# EAGLE design OmniRotor-1_0 (EAGLE 5.10)
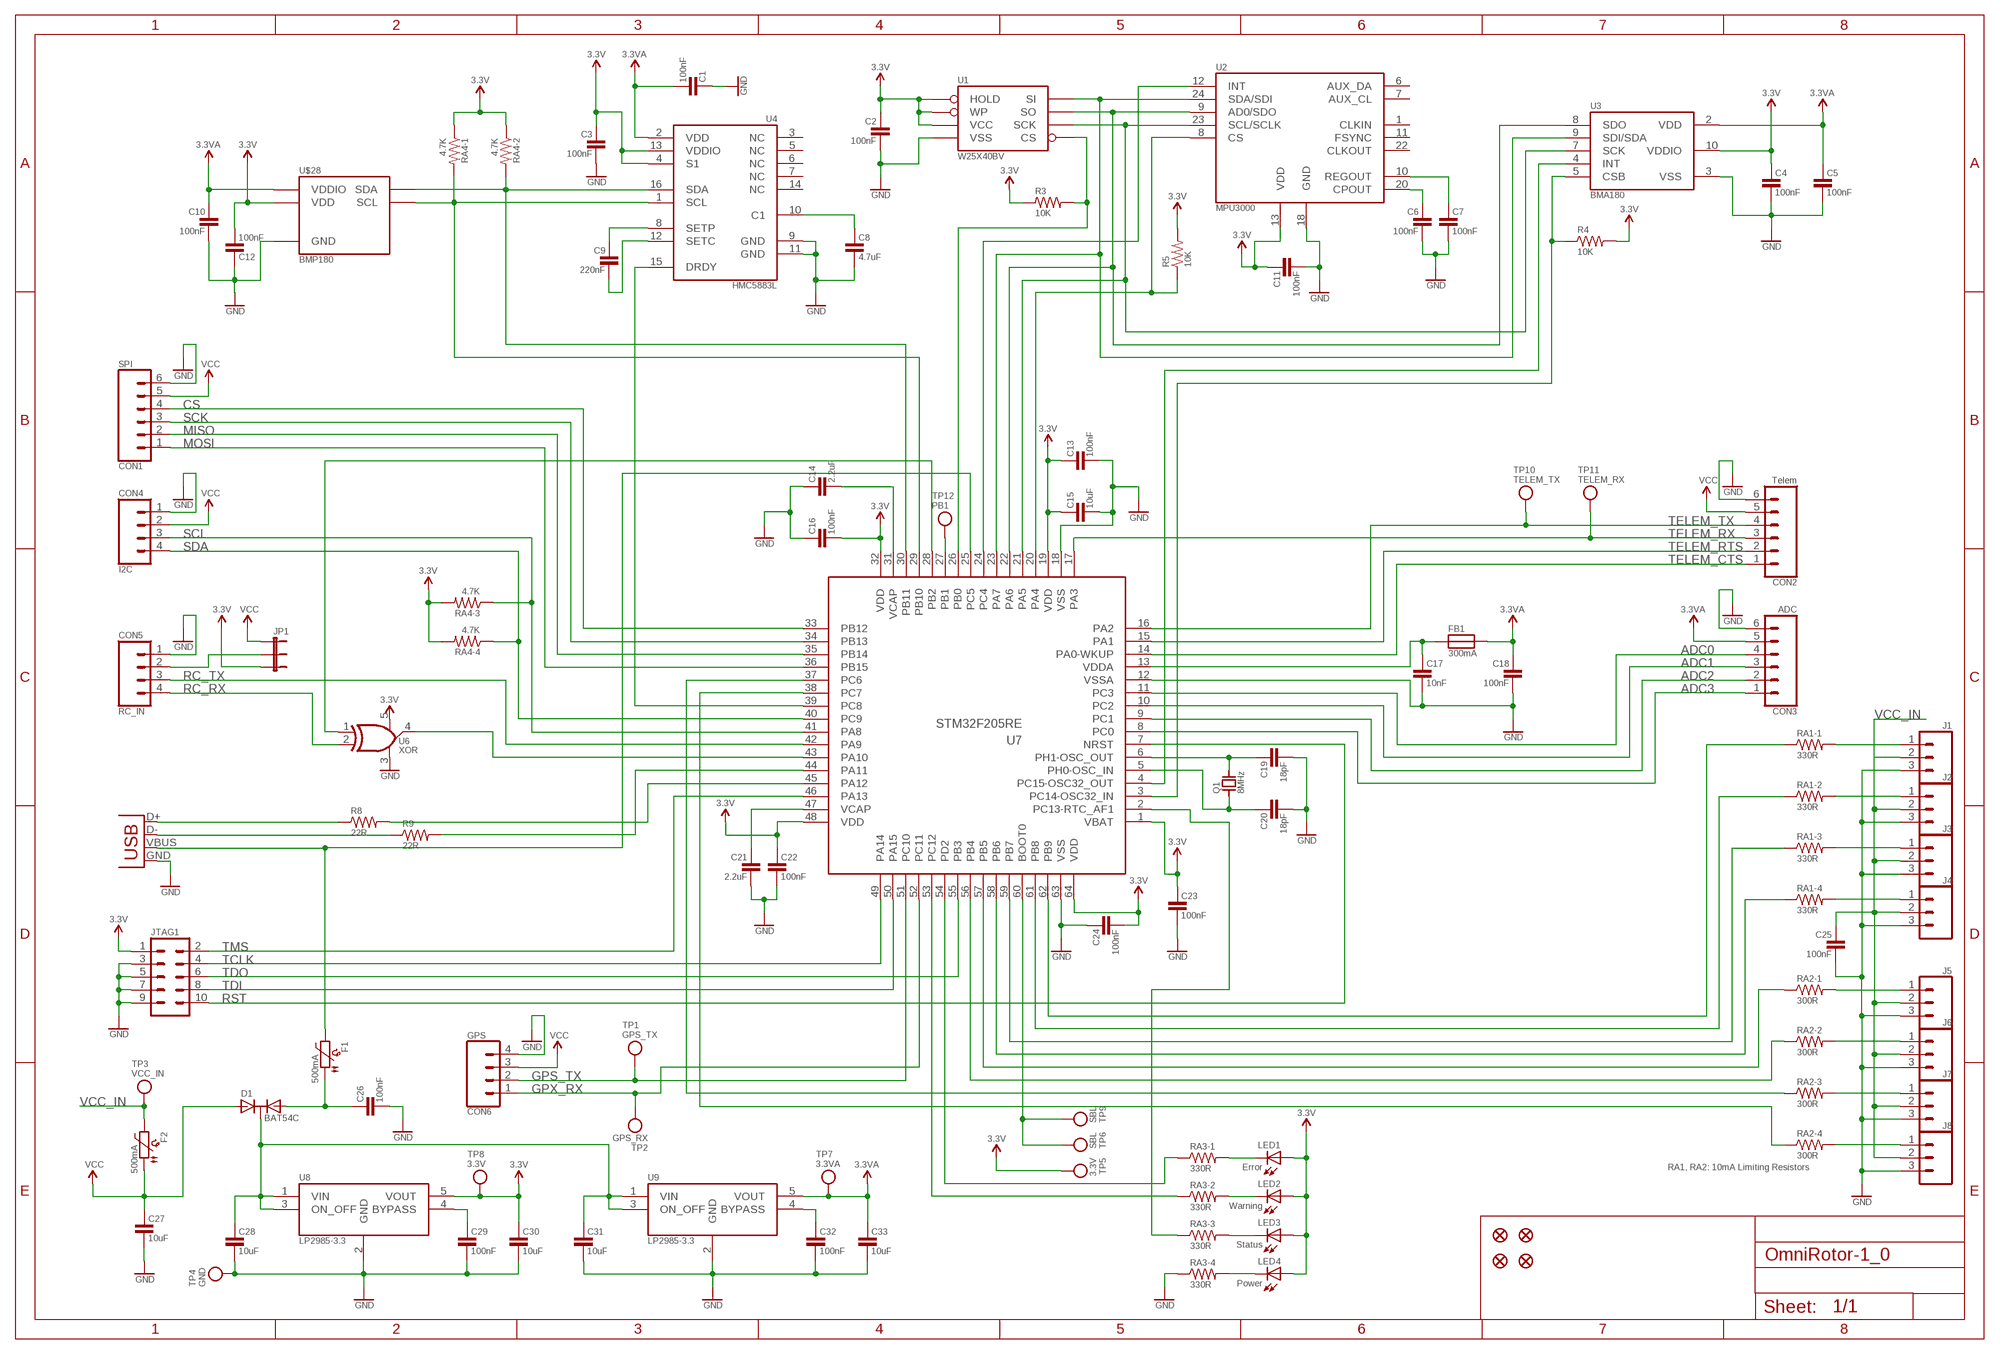
[diagram p0: schematic, sheet 1]

## Parts
C1  100nF  CAPACITOR0402  [0402-CAP]
C2  100nF  CAPACITOR0402  [0402-CAP]
C3  100nF  CAPACITOR0402  [0402-CAP]
C4  100nF  CAPACITOR0402  [0402-CAP]
C5  100nF  CAPACITOR0402  [0402-CAP]
C6  100nF  CAPACITOR0402  [0402-CAP]
C7  100nF  CAPACITOR0402  [0402-CAP]
C8  4.7uF  CAPACITOR0603  [0603]
C9  220nF  CAPACITOR0402  [0402-CAP]
C10  100nF  CAPACITOR0402  [0402-CAP]
C11  100nF  CAPACITOR0402  [0402-CAP]
C12  100nF  CAPACITOR0402  [0402-CAP]
C13  100nF  CAPACITOR0402  [0402-CAP]
C14  2.2uF  CAPACITOR0603  [0603]
C15  10uF  CAPACITOR-CERAMIC0805  [0805]
C16  100nF  CAPACITOR0402  [0402-CAP]
C17  10nF  CAPACITOR0402  [0402-CAP]
C18  100nF  CAPACITOR0402  [0402-CAP]
C19  18pF  CAPACITOR0402  [0402-CAP]
C20  18pF  CAPACITOR0402  [0402-CAP]
C21  2.2uF  CAPACITOR0603  [0603]
C22  100nF  CAPACITOR0402  [0402-CAP]
C23  100nF  CAPACITOR0402  [0402-CAP]
C24  100nF  CAPACITOR0402  [0402-CAP]
C25  100nF  CAPACITOR0402  [0402-CAP]
C26  100nF  CAPACITOR0402  [0402-CAP]
C27  10uF  CAPACITOR-CERAMIC0805  [0805]
C28  10uF  CAPACITOR-CERAMIC0805  [0805]
C29  100nF  CAPACITOR0402  [0402-CAP]
C30  10uF  CAPACITOR-CERAMIC0805  [0805]
C31  10uF  CAPACITOR-CERAMIC0805  [0805]
C32  100nF  CAPACITOR0402  [0402-CAP]
C33  10uF  CAPACITOR-CERAMIC0805  [0805]
CON1  SPI  M06JST-SH-SIDE  [SM06B-SRSS-TB]
CON2  Telem  M06JST-SH-SIDE  [SM06B-SRSS-TB]
CON3  ADC  M06JST-SH-SIDE  [SM06B-SRSS-TB]
CON4  I2C  M04JST-SH-SIDE  [SM04B-SRSS-TB]
CON5  RC_IN  M04JST-SH-SIDE  [SM04B-SRSS-TB]
CON6  GPS  M04JST-SH-SIDE  [SM04B-SRSS-TB]
D1  BAT54C  [SOT23]
F1  500mA  PTC1812  [1812]
F2  500mA  PTC1812  [1812]
FB1  300mA  FERRITE0603  [0603]
FID1  FIDUCIAL1X2.5  [FIDUCIAL-1X2.5]
FID2  FIDUCIAL1X2.5  [FIDUCIAL-1X2.5]
FID3  FIDUCIAL1X2.5  [FIDUCIAL-1X2.5]
FID4  FIDUCIAL1X2.5  [FIDUCIAL-1X2.5]
J1  M03PTH  [1X03]
J2  M03PTH  [1X03]
J3  M03PTH  [1X03]
J4  M03PTH  [1X03]
J5  M03PTH  [1X03]
J6  M03PTH  [1X03]
J7  M03PTH  [1X03]
J8  M03PTH  [1X03]
JP1  JUMPER-32-3  [SJ_3_PASTE2&3]
JTAG1  JTAGSWD  [2X05-0.05IN]
LED1  Error  LED0603  [0603_LED]
LED2  Warning  LED0603  [0603_LED]
LED3  Status  LED0603  [0603_LED]
LED4  Power  LED0603  [0603_LED]
Q1  8MHz  CRYSTAL5X3  [CRYSTAL-5X3]
R3  10K  RESISTOR0402  [0402-RES]
R4  10K  RESISTOR0402  [0402-RES]
R5  10K  RESISTOR0402  [0402-RES]
R8  22R  RESISTOR0402  [0402-RES]
R9  22R  RESISTOR0402  [0402-RES]
RA1  330R  RESISTOR-ARRAY-1206  [1206-ARRAY]
RA2  300R  RESISTOR-ARRAY-1206  [1206-ARRAY]
RA3  330R  RESISTOR-ARRAY-1206  [1206-ARRAY]
RA4  4.7K  RESISTOR-ARRAY-1206  [1206-ARRAY]
TP1  GPS_TX  TESTPOINTROUND1MM  [TESTPOINT_ROUND_1MM]
TP2  GPS_RX  TESTPOINTROUND1MM  [TESTPOINT_ROUND_1MM]
TP3  VCC_IN  TESTPOINTROUND1.5MM  [TESTPOINT_ROUND_1.5MM]
TP4  GND  TESTPOINTROUND1.5MM  [TESTPOINT_ROUND_1.5MM]
TP5  3.3V  TESTPOINTROUND1.5MM  [TESTPOINT_ROUND_1.5MM]
TP6  SBL  TESTPOINTROUND1.5MM  [TESTPOINT_ROUND_1.5MM]
TP7  3.3VA  TESTPOINTROUND1MM  [TESTPOINT_ROUND_1MM]
TP8  3.3V  TESTPOINTROUND1MM  [TESTPOINT_ROUND_1MM]
TP9  SBL  TESTPOINTROUND1MM  [TESTPOINT_ROUND_1MM]
TP10  TELEM_TX  TESTPOINTROUND1MM  [TESTPOINT_ROUND_1MM]
TP11  TELEM_RX  TESTPOINTROUND1MM  [TESTPOINT_ROUND_1MM]
TP12  PB1  TESTPOINTROUND1MM  [TESTPOINT_ROUND_1MM]
U1  W25X40BV  W25X40BVSOIC  [SOIC8]
U2  MPU3000  [QFN-24]
U3  BMA180  [LGA12]
U4  HMC5883L  [16LPCC]
U6  XOR  74LVC1G86SC70  [SC-70-5]
U7  STM32F205RE  [LQFP64]
U8  LP2985-3.3  LP2985  [SOT-23-5]
U9  LP2985-3.3  LP2985  [SOT-23-5]
U$28  BMP180  [BMP180]
USB1  USB-MICRO-B  USBMICRO-B  [USB-MICRO-B]

## Nets
3.3V: C2.1 C3.1 C4.1 C11.1 C12.2 C13.1 C15.1 C16.2 C22.1 C23.1 C24.2 C30.1 JP1.3 JTAG1.1 LED1.1(A) LED2.1(A) LED3.1(A) LED4.1(A) R3.1 R4.2 R5.2 RA4.A1 RA4.B1 RA4.C2 RA4.D2 TP5.1 TP8.1 U1.3(WP) U1.7(HOLD) U1.8(VCC) U2.13(VDD) U3.10(VDDIO) U4.4(S1) U4.13(VDDIO) U6.5(VCC) U7.1(VBAT) U7.19(VDD) U7.32(VDD) U7.48(VDD) U7.64(VDD) U8.5(VOUT)
3.3VA: C1.2 C5.1 C10.1 C18.1 C33.1 CON3.5 FB1.2 TP7.1 U3.2(VDD) U4.2(VDD) U9.5(VOUT) U$28.3(VDDIO)
ADC0: CON3.4 U7.11(PC3)
ADC1: CON3.3 U7.10(PC2)
ADC2: CON3.2 U7.9(PC1)
ADC3: CON3.1 U7.8(PC0)
CS: CON1.4 U7.33(PB12)
GND: C1.1 C2.2 C3.2 C4.2 C5.2 C6.2 C7.2 C8.2 C10.2 C11.2 C12.1 C13.2 C14.1 C15.2 C16.1 C17.2 C18.2 C19.2 C20.2 C21.2 C22.2 C23.2 C24.1 C25.2 C26.2 C27.2 C28.2 C29.2 C30.2 C31.2 C32.2 C33.2 CON1.6 CON2.6 CON3.6 CON4.1 CON5.1 CON6.4 J1.3 J2.3 J3.3 J4.3 J5.3 J6.3 J7.3 J8.3 JTAG1.3 JTAG1.5 JTAG1.7 JTAG1.9 RA3.D1 TP4.1 U1.4(VSS) U2.18(GND) U3.3(VSS) U4.9(GND) U4.11(GND) U6.3(GND) U7.12(VSSA) U7.18(VSS) U7.63(VSS) U8.2(GND) U9.2(GND) U$28.7(GND) USB1.GND
GPS_TX: CON6.2 TP1.1 U7.51(PC10)
GPX_RX: CON6.1 TP2.1 U7.52(PC11)
MISO: CON1.2 U7.35(PB14)
MOSI: CON1.1 U7.36(PB15)
N$1: C17.1 FB1.1 U7.13(VDDA)
N$2: C19.1 Q1.3 U7.6(PH1-OSC_OUT)
N$3: C20.1 Q1.1 U7.5(PH0-OSC_IN)
N$4: C26.1 D1.2 F1.2
N$5: C29.1 U8.4(BYPASS)
N$6: CON5.2 JP1.2
N$7: C32.1 U9.4(BYPASS)
N$8: R8.1 USB1.D+
N$9: R9.1 USB1.D-
N$10: R9.2 U7.44(PA11)
N$11: R8.2 U7.45(PA12)
N$12: C28.1 C31.1 D1.3 U8.1(VIN) U8.3(ON_OFF) U9.1(VIN) U9.3(ON_OFF)
N$13: U6.4(O) U7.43(PA10)
N$14: U6.1(I0) U7.28(PB2)
N$15: C9.1 U4.8(SETP)
N$16: C9.2 U4.12(SETC)
N$17: R5.1 U2.8(CS) U7.20(PA4)
N$18: U4.15(DRDY) U7.39(PC8)
N$19: TP12.1 U7.27(PB1)
N$20: C8.1 U4.10(C1)
N$22: U1.5(SI) U2.24(SDA/SDI) U3.9(SDI/SDA) U7.23(PA7)
N$23: RA4.A2 U4.1(SCL) U7.29(PB10) U$28.5(SCL)
N$24: RA4.B2 U4.16(SDA) U7.30(PB11) U$28.6(SDA)
N$25: U1.2(SO) U2.9(AD0/SDO) U3.8(SDO) U7.22(PA6)
N$26: R3.2 U1.1(CS) U7.26(PB0)
N$27: U1.6(SCK) U2.23(SCL/SCLK) U3.7(SCK) U7.21(PA5)
N$28: U2.12(INT) U7.24(PC4)
N$30: U3.4(INT) U7.4(PC15-OSC32_OUT)
N$31: C6.1 U2.20(CPOUT)
N$32: C7.1 U2.10(REGOUT)
N$33: R4.1 U3.5(CSB) U7.3(PC14-OSC32_IN)
N$34: J2.1 RA1.B2
N$35: J3.1 RA1.C2
N$36: J4.1 RA1.D2
N$37: J1.1 RA1.A2
N$38: J6.1 RA2.B2
N$39: J7.1 RA2.C2
N$40: J8.1 RA2.D2
N$41: J5.1 RA2.A2
N$42: RA1.D1 U7.58(PB6)
N$43: RA1.C1 U7.59(PB7)
N$44: RA1.B1 U7.61(PB8)
N$45: RA1.A1 U7.62(PB9)
N$46: TP6.1 TP9.1 U7.60(BOOT0)
N$47: RA2.A1 U7.57(PB5)
N$48: RA2.B1 U7.56(PB4)
N$49: RA2.C1 U7.37(PC6)
N$50: RA2.D1 U7.38(PC7)
N$51: LED1.2(C) RA3.A2
N$52: LED2.2(C) RA3.B2
N$53: LED3.2(C) RA3.C2
N$54: LED4.2(C) RA3.D2
N$55: RA3.B1 U7.53(PC12)
N$56: RA3.A1 U7.54(PD2)
N$57: RA3.C1 U7.2(PC13-RTC_AF1)
RC_RX: CON5.4 U6.2(I1)
RC_TX: CON5.3 U7.42(PA9)
RST: JTAG1.10 U7.7(NRST)
SCK: CON1.3 U7.34(PB13)
SCL: CON4.3 RA4.C1 U7.41(PA8)
SDA: CON4.4 RA4.D1 U7.40(PC9)
TCLK: JTAG1.4 U7.49(PA14)
TDI: JTAG1.8 U7.50(PA15)
TDO: JTAG1.6 U7.55(PB3)
TELEM_CTS: CON2.1 U7.14(PA0-WKUP)
TELEM_RTS: CON2.2 U7.15(PA1)
TELEM_RX: CON2.3 TP11.1 U7.17(PA3)
TELEM_TX: CON2.4 TP10.1 U7.16(PA2)
TMS: JTAG1.2 U7.46(PA13)
VCAP: C21.1 U7.47(VCAP)
VCAP2: C14.2 U7.31(VCAP)
VCC: C27.1 CON1.5 CON2.5 CON4.2 CON6.3 D1.1 F2.2 JP1.1
VCC_IN: C25.1 F2.1 J1.2 J2.2 J3.2 J4.2 J5.2 J6.2 J7.2 J8.2 TP3.1
VUSB: F1.1 U7.25(PC5) USB1.VBUS
Unconnected: U2.1(CLKIN) U2.6(AUX_DA) U2.7(AUX_CL) U2.11(FSYNC) U2.22(CLKOUT) U4.3(NC) U4.5(NC) U4.6(NC) U4.7(NC) U4.14(NC)

## Notes on the sheet
- RA1, RA2: 10mA Limiting Resistors

## Power pins joined to a net without a drawn wire
3.3V: U$28.2(VDD)

## Library data of the parts
C1-C14 C16-C26 C29 C32 = OmniLoco:CAPACITOR: Capacitor Standard SMD ceramic capacitors.
C15 C27 C28 C30 C31 C33 = OmniLoco:CAPACITOR-CERAMIC: Ceramic Capacitors 0402 - 0402 Surface Mount Capacitors 18pF 50V 5% [Digikey: 587-1950-1-ND] 10nF 6.3V 10% [Digikey: 311-1349-1-ND] 0.1uF 10V 10% [Digikey: 587-1227-1-ND] 0.1uF 16V 10% [Digikey: 587-1451-1-ND] 0.22uF 6.3V 10% [Digikey: 587-1229-1-ND] 0603 - 0603 Surface Mount Capacitors 2.2uF 6.3V 10% [Digikey: 587-1254-1-ND] 2.2uF 10V 10% [Digikey: 587-1253-1-ND] 4.7uF 6.3V 10% [Digikey: 587-1785-1-ND] 0805 - 0805 Surface Mount Capacitors 10uF 16V 10% [Digikey: 587-1295-1-ND]
CON1-CON3 = OmniLoco:M06: Six Way Connector JST SH/SR Vertical Connector - BM06B-SRSS-TB(LF)(SN) [Digikey: 455-1792-1-ND] JST SH/SR Right-Angle Connector - SM06B-SRSS-TB(LF)(SN) [Digikey: 455-1806-1-ND] JST-SH-TOP - Vertical JST-SH footprint. JST-SH-SIDE - Right-angle JST-SH footprint.
CON4-CON6 = OmniLoco:M04: Four Way Connector JST SH/SR Vertical Connector - BM04B-SRSS-TB(LF)(SN)(P) [Digikey: 455-1790-1-ND] JST SH/SR Right-Angle Connector - SM04B-SRSS-TB(LF)(SN)(P) [Digikey: 455-1804-1-ND] JST-SH-TOP - Vertical JST-SH footprint. JST-SH-SIDE - Right-angle JST-SH footprint.
D1 = OmniLoco:BAT54C: BAT54C Schottky Diodes (Common Cathode) Vf: 800mV, 30V 200mA - BAT543C [Digikey: BAT54CFSCT-ND] Vf: 900mV, 40V 300mA - BAT54CFILM [Digikey: 497-3786-2-ND]
F1 F2 = OmniLoco:PTC: PTC (Resettable Fuse) 1812 Package 200mA PTC (30V Max, Time-to-Trip: 0.02s) - Digikey: 507-1496-1-ND 750mA PTC (24V Max, Time-to-Trip: 0.2s) - Digikey: MF-MSMF075/24-2CT-ND
FB1 = OmniLoco:FERRITE: Ferrite Bead 0603 HZ0603B102R-10 - 1K Ohm, 200mA [Digikey: 240-2378-1-ND] 742792664 - 1K Ohm, 300mA [Digikey: 732-1586-1-ND]
FID1-FID4 = OmniLoco:FIDUCIAL: Fiducial Alignment Points Various fiducial points for machine vision alignment.
J1-J8 = OmniLoco:M03: Three Way Connector PTH - Standard 0.1" through-hole footprint.
JP1 = OmniLoco:JUMPER-3: Three Way Jumpers
JTAG1 = OmniLoco:JTAG: JTAG Connector 0.05" SWD Vertical - GRPB052VWQS-RC - [Digikey: S9012E-05-ND]
LED1-LED4 = OmniLoco:LED: LED - Light Emmiting Diodes LED 0603 (20mA 220mCd Vf1.95) Red - APT1608SURCK [Digikey: 754-1123-1-ND] LED 0603 (20mA 240mCd Vf=2.1) Orange - APT1608SECK [Digikey: 754-1120-1-ND] LED 0603 (20mA 100mCd Vf=3.3) Blue - APT1608QBC/D [Digikey: 754-1434-1-ND] LED 0603 (20mA 50mCd Vf=2.1) Green - APT1608CGCK [Digikey: 754-1116-1-ND] Light Pipes 0.400" (10.16mm) High Round Lightpipe - VLP-400-R [Digikey: VLP-400-R-ND] 0.350" (8.89mm) High Round Lightpipe - VLP-350-F [Digikey: 492-1309-ND] 0603 - Standard 0603 footprint with LED silkscreen markings. 0603-LP - Standard 0603 footprint with mounting holes and clearances for VLP-XXX series lightpipes. 1206 - Standard 1206 footprint.
Q1 = OmniLoco:CRYSTAL: Crystals 5x3.2MM - Surface Mount Crystal 8.0MHz 18pF +/-50ppm [Digikey: 535-9720-1-ND]
R3-R5 R8 R9 = OmniLoco:RESISTOR: Resistors 0402 - 0402 Surface Mount Resistors 22 Ohm 1/16W 5% [Digikey: 311-22JRCT-ND] 4.7K Ohm 1/16W 5% [Digikey: 311-4.7KJRCT-ND] 10K Ohm 1/16W 5% [Digikey: 311-10KJRCT-ND]
RA1-RA4 = OmniLoco:RESISTOR-ARRAY: Resistor Arrays 1206 (Concave) - 1206 (Concave) Surface Mount Resistor Arrays 330 Ohm 1/16W 5% [Digikey: TC164J-330CT-ND]
TP1-TP12 = OmniLoco:TESTPOINT: Testpoint Footprints for testpoints, commonly used for debugging or connection points for pogopins. POGOPIN1MM - Throughhole footprint for 1mm pogopins. ROUND1MM - Smallest testpoint, for use with pogopins. ROUND1.5MM - Larger testpoint, more suited to handheld probing.
U1 = OmniLoco:W25X40BV: W25Xx0BV - SPI Flash 4Mbit SPI Flash - W25X40BVSNIG [Digikey: W25X40BVSNIG-ND]
U2 = OmniLoco:MPU3000: MPU3000 - Invensense Digital Gyroscope 3 Axis Digital Gyroscope - MPU3000 [Invensense: MPU-3000]
U3 = OmniLoco:BMA180: BMA180 - Bosch Sensortec Accelerometer 3-Axis Accelerometer - BMA180 [Digikey: 828-1019-1-ND]
U4 = OmniLoco:HMC5883L: HMC5883L - Honeywell Magnetic Sensor 3 Axis Digital Compass IC - HMC5883L [Digikey: 342-1082-1-ND]
U6 = OmniLoco:74LVC1G86: XOR Logic Gate - 7400 Series Logic Exclusive OR Gate (Inverter) SC-70-5 - SN74LVC1G86DCKR [Digikey: 296-9854-1-ND] Exclusive OR Gate (Inverter) SOT353 - 74LVC1G86SE-7 [Digikey: 74LVC1G86SE-7DICT-ND] SOT353 - Standard SOT353 package. SC70 - Smaller SC-70-5 package for high density designs.
U7 = OmniLoco:STM32F205
U8 U9 = OmniLoco:LP2985: LP2985 - Low Dropout Linear Regulator 3.3V 150mA - LP2985-33DBVR [Digikey: 296-18476-1-ND]
U$28 = OmniLoco:BMP180: BMP180 - Bosch Sensortec Pressure Sensor Barometric Pressure Sensor - BMP180 [Digikey: 828-1027-1-ND]
USB1 = OmniLoco:USB: USB Connectors Micro USB - ZX62-B-5PA(11) [Digikey: H11634CT-ND]

## Board
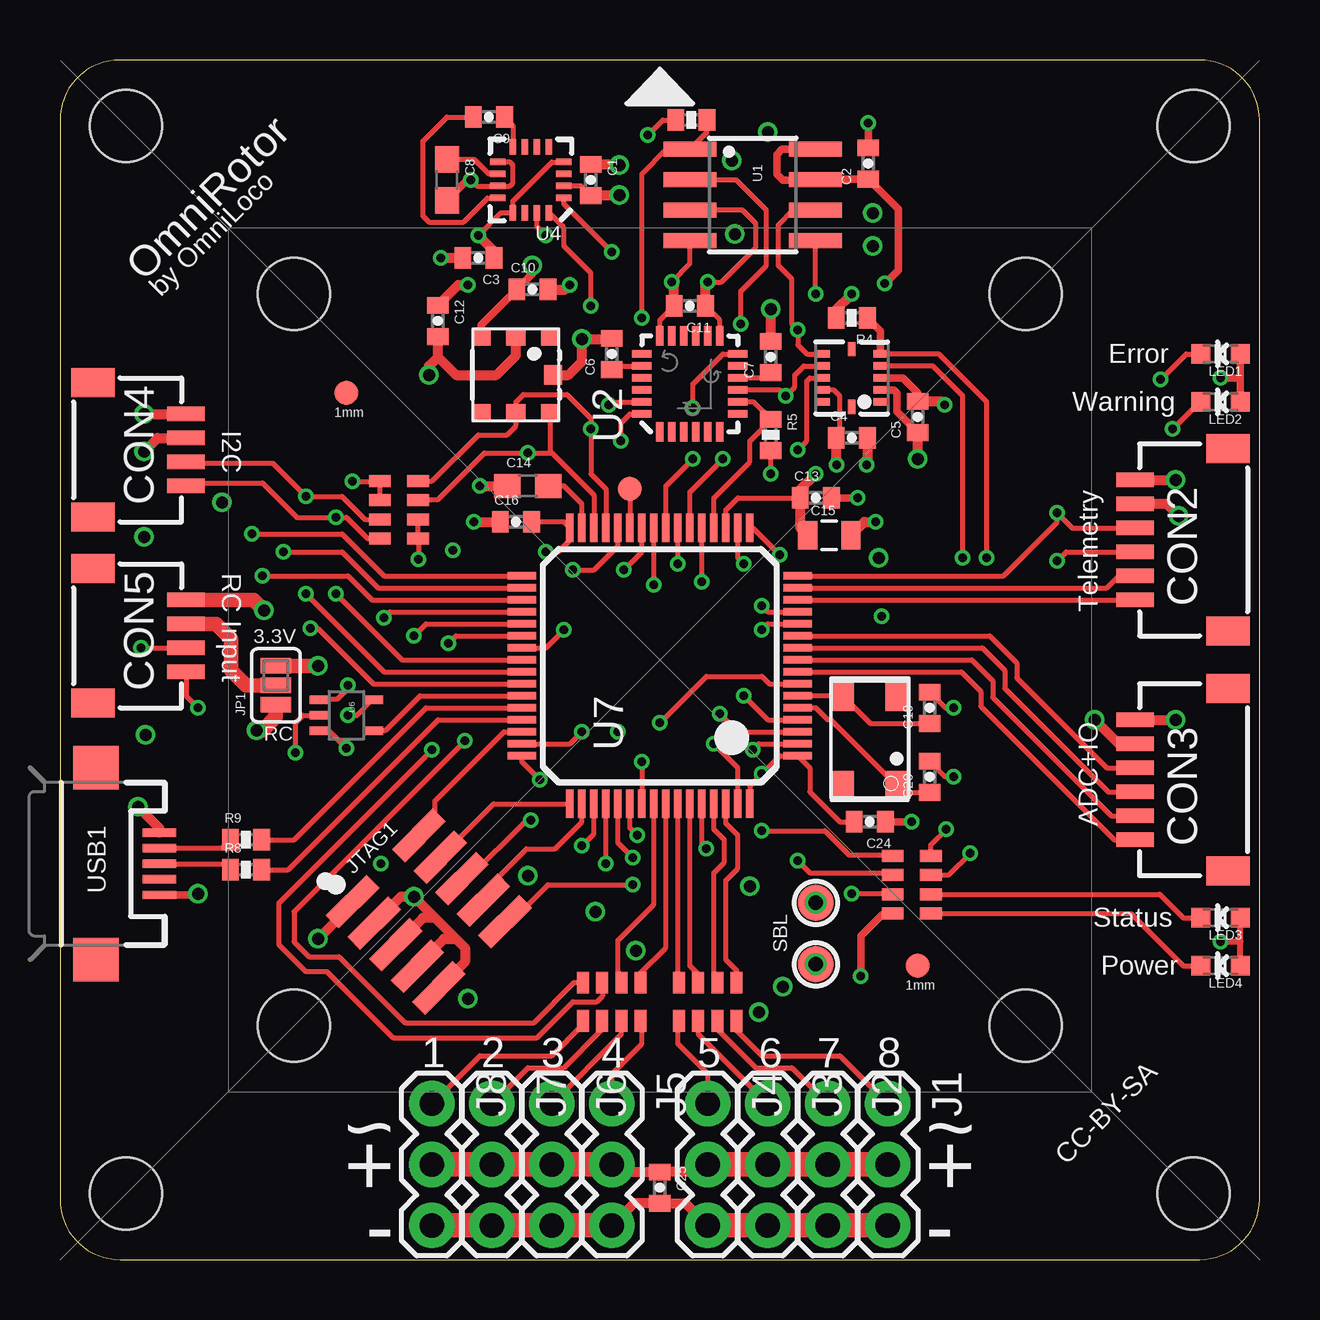
[diagram p1: board, top side]
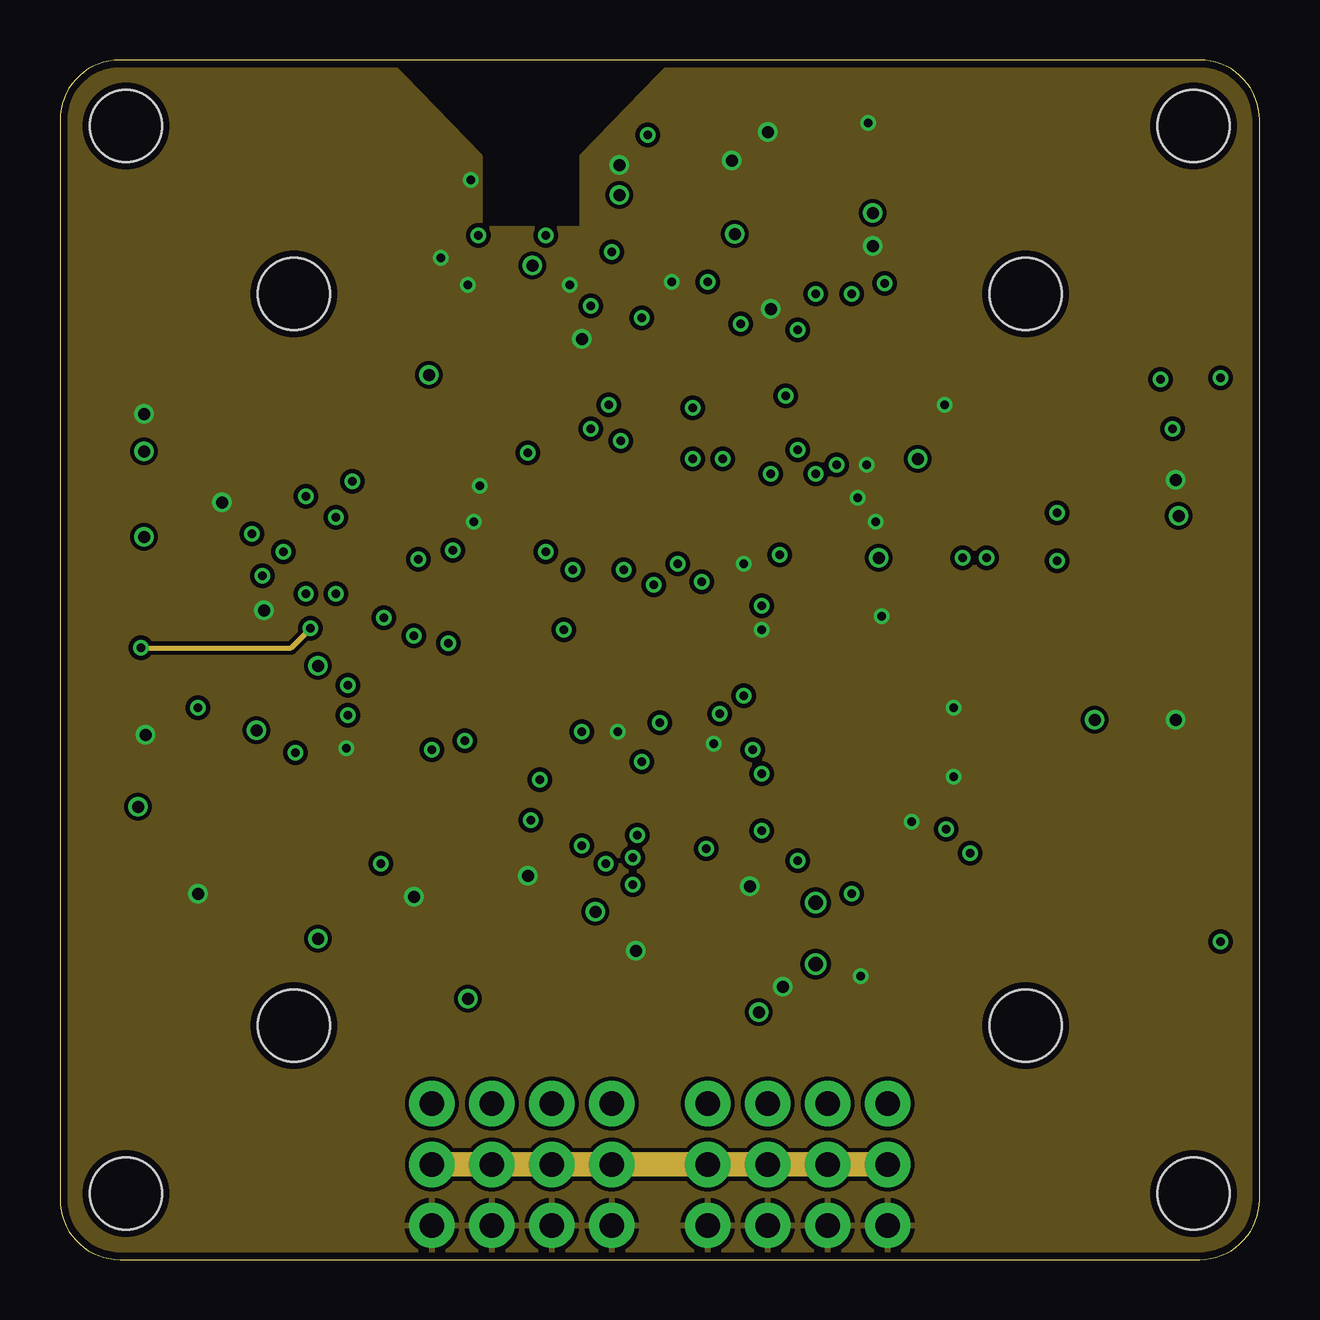
[diagram p2: board, inner layer Route2]
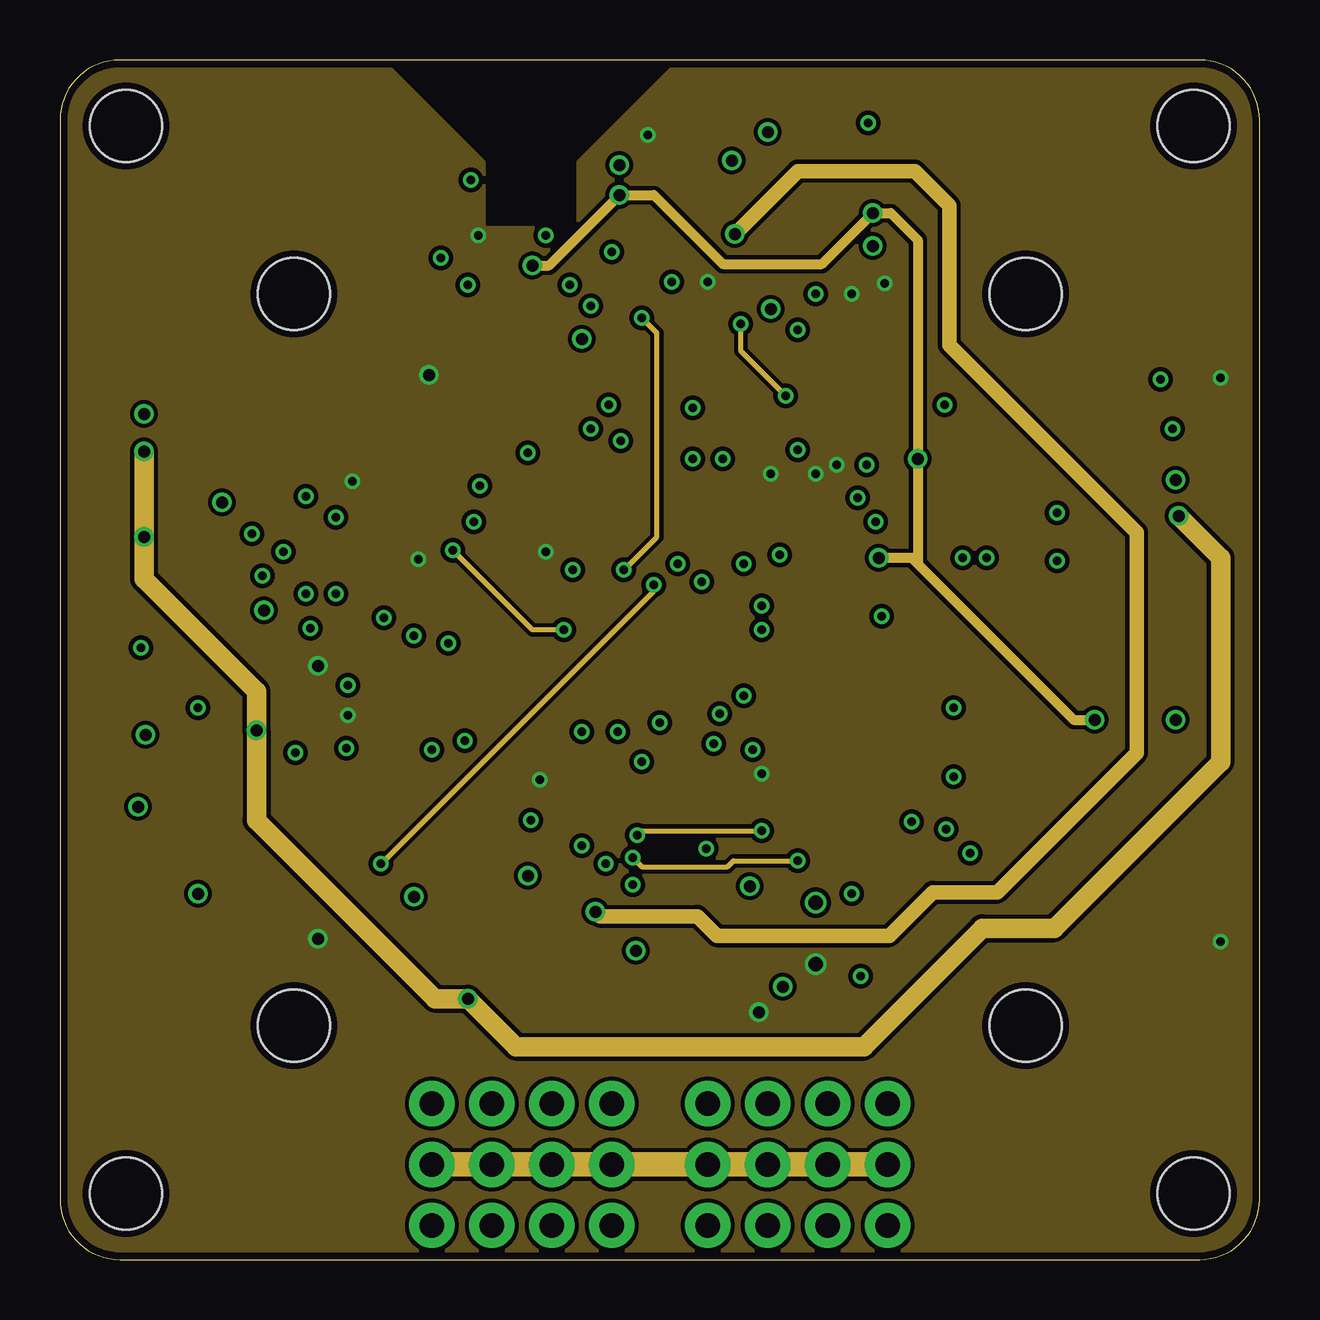
[diagram p3: board, inner layer Route15]
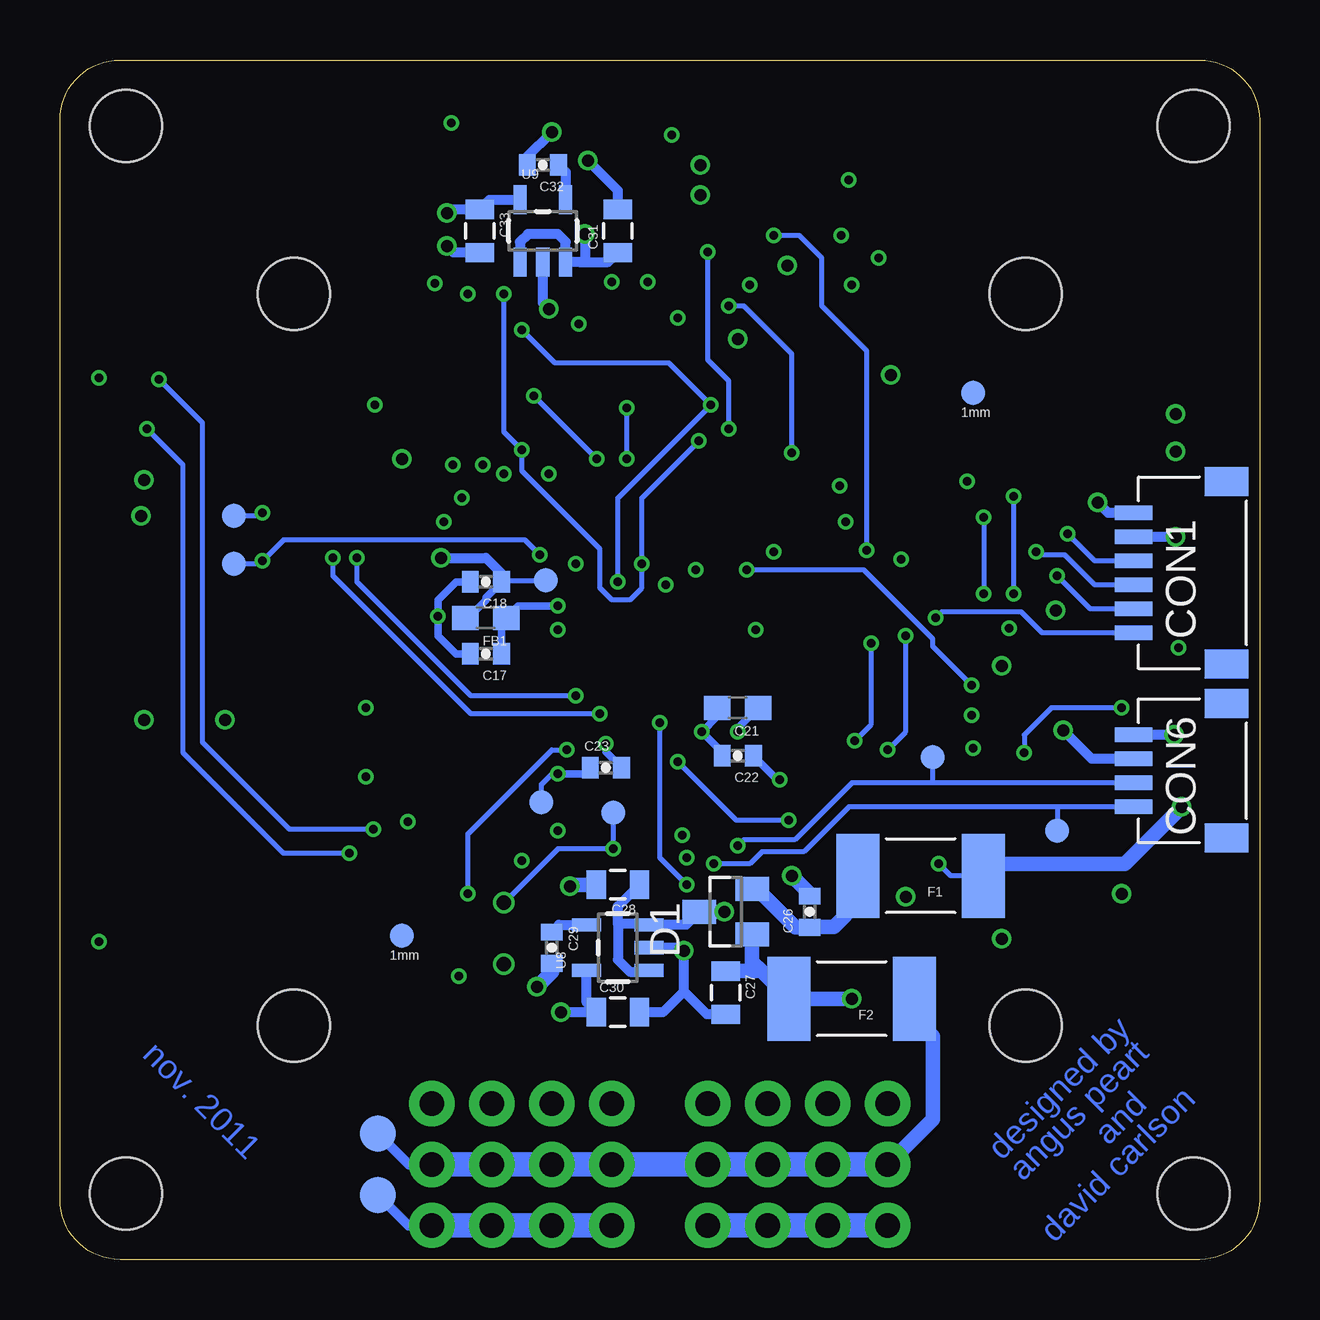
[diagram p4: board, bottom side, seen from below]

Size 50 x 50 mm. Coordinates in mm from the lower left corner, seen from the top.
Outline: 50,47.5 arc90 47.5,50 2.5,50 arc90 0,47.5 0,2.5 arc90 2.5,0 47.5,0 arc90 50,2.5 50,47.5
Copper layers (1*2+15*16): Top 0.0356mm / dielectric 1.5011mm / Route2 0.0356mm / dielectric 0.1499mm / Route15 0.0356mm / dielectric 0.2007mm / Bottom 0.0356mm
Design rules "PCBWing (4 Layer)": minimum track width 0.15mm, minimum drill 0.3mm, track to track 7mil, track to pad 7mil, pad to pad 7mil, via to via 7mil, smd to smd 7mil, copper to edge 0.3mm, drill to drill 0.3mm, minimum pad ring 10mil, minimum via ring 0.15mm, stop-mask expansion 4mil, vias tented up to drill 25mil, thermal gap 8mil
Holes 3 mm at 9.75,40.25 40.25,40.25 40.25,9.75 9.75,9.75 2.75,47.25 47.25,47.25 47.25,2.75 2.75,2.75
tKeepout: area 0.2,0.2 to 5.2,5.2; area 7.2,7.2 to 12.2,12.2; area 0.2,44.8 to 5.2,49.8; area 7.2,37.8 to 12.2,42.8; area 37.8,37.8 to 42.8,42.8; area 37.8,7.2 to 42.8,12.2; area 44.8,0.2 to 49.8,5.2; area 44.8,44.8 to 49.8,49.8

### Footprints (pad centres in the part's own frame; a part is rotated, then mirrored left to right if it is on the bottom)
0402-CAP = smd 0.7 x 0.9: 1 -0.65,0; 2 0.65,0
0603 = smd 1.1 x 1: 1 -0.85,0; 2 0.85,0
0805 = smd 0.8 x 1.2: 1 -0.9,0; 2 0.9,0
SM06B-SRSS-TB = smd 0.6 x 1.55: 1 0,0; 2 1,0; 3 2,0; 4 3,0; 5 4,0; 6 5,0 | smd 1.2 x 1.8: NC@1 -1.3,-3.875; NC@2 6.3,-3.875
SM04B-SRSS-TB = smd 0.6 x 1.55: 1 0,0; 2 1,0; 3 2,0; 4 3,0 | smd 1.2 x 1.8: NC@1 -1.3,-3.875; NC@2 4.3,-3.875
SOT23 = smd 1 x 1.4: 1 -0.95,-1.1; 2 0.95,-1.1; 3 0,1.1
1812 = smd 1.78 x 3.5: 1 -2.615,0; 2 2.615,0
FIDUCIAL-1X2.5 = smd 1 x 1: 1 0,0
1X03 = drill 1.016 pad 1.88 round: 1 0,0; 2 2.54,0; 3 5.08,0
SJ_3_PASTE2&3 = smd 0.635 x 1.27: 1 -0.813,0; 2 0,0; 3 0.813,0
2X05-0.05IN = smd 0.76 x 2.4: 1 -2.54,-1.95; 2 -2.54,1.95; 3 -1.27,-1.95; 4 -1.27,1.95; 5 0,-1.95; 6 0,1.95; 7 1.27,-1.95; 8 1.27,1.95; 9 2.54,-1.95; 10 2.54,1.95
0603_LED = smd 0.8 x 0.8: 1 -0.825,0; 2 0.825,0
CRYSTAL-5X3 = smd 1.2 x 0.9: 1 1.85,1.1; 2 -1.85,1.1; 3 -1.85,-1.1; 4 1.85,-1.1
0402-RES = smd 0.7 x 0.9: 1 -0.65,0; 2 0.65,0
1206-ARRAY = smd 0.9 x 0.5: A1 -0.8,1.2; A2 0.8,1.2; B1 -0.8,0.4; B2 0.8,0.4; C1 -0.8,-0.4; C2 0.8,-0.4; D1 -0.8,-1.2; D2 0.8,-1.2
TESTPOINT_ROUND_1MM = smd 1 x 1: 1 0,0
TESTPOINT_ROUND_1.5MM = smd 1.5 x 1.5: 1 0,0
SOIC8 = smd 0.61 x 2.21: 1 -1.905,-2.616; 2 -0.635,-2.616; 3 0.635,-2.616; 4 1.905,-2.616; 5 1.905,2.616; 6 0.635,2.616; 7 -0.635,2.616; 8 -1.905,2.616
QFN-24 = smd 0.8 x 0.3: 1 -2,1.25; 2 -2,0.75; 3 -2,0.25; 4 -2,-0.25; 5 -2,-0.75; 6 -2,-1.25; 13 2,-1.25; 14 2,-0.75; 15 2,-0.25; 16 2,0.25; 17 2,0.75; 18 2,1.25 | smd 0.3 x 0.8: 7 -1.25,-2; 8 -0.75,-2; 9 -0.25,-2; 10 0.25,-2; 11 0.75,-2; 12 1.25,-2; 19 1.25,2; 20 0.75,2; 21 0.25,2; 22 -0.25,2; 23 -0.75,2; 24 -1.25,2
LGA12 = smd 0.32 x 0.6: 1 -1,-1.2; 2 -0.5,-1.2; 3 0,-1.2; 4 0.5,-1.2; 5 1,-1.2; 7 1,1.2; 8 0.5,1.2; 9 0,1.2; 10 -0.5,1.2; 11 -1,1.2 | smd 0.6 x 0.32: 6 1.2,0; 12 -1.2,0
16LPCC = smd 0.65 x 0.28: 1 -1.37,0.75; 2 -1.37,0.25; 3 -1.37,-0.25; 4 -1.37,-0.75; 9 1.37,-0.75; 10 1.37,-0.25; 11 1.37,0.25; 12 1.37,0.75 | smd 0.28 x 0.65: 5 -0.75,-1.37; 6 -0.25,-1.37; 7 0.25,-1.37; 8 0.75,-1.37; 13 0.75,1.37; 14 0.25,1.37; 15 -0.25,1.37; 16 -0.75,1.37
SC-70-5 = smd 0.35 x 0.85: 1 -0.65,-1.1; 2 0,-1.1; 3 0.65,-1.1; 4 0.65,1.1; 5 -0.65,1.1
LQFP64 = smd 0.3 x 1.2: 1 -3.75,-5.75; 2 -3.25,-5.75; 3 -2.75,-5.75; 4 -2.25,-5.75; 5 -1.75,-5.75; 6 -1.25,-5.75; 7 -0.75,-5.75; 8 -0.25,-5.75; 9 0.25,-5.75; 10 0.75,-5.75; 11 1.25,-5.75; 12 1.75,-5.75; 13 2.25,-5.75; 14 2.75,-5.75; 15 3.25,-5.75; 16 3.75,-5.75; 33 3.75,5.75; 34 3.25,5.75; 35 2.75,5.75; 36 2.25,5.75; 37 1.75,5.75; 38 1.25,5.75; 39 0.75,5.75; 40 0.25,5.75; 41 -0.25,5.75; 42 -0.75,5.75; 43 -1.25,5.75; 44 -1.75,5.75; 45 -2.25,5.75; 46 -2.75,5.75; 47 -3.25,5.75; 48 -3.75,5.75 | smd 1.2 x 0.3: 17 5.75,-3.75; 18 5.75,-3.25; 19 5.75,-2.75; 20 5.75,-2.25; 21 5.75,-1.75; 22 5.75,-1.25; 23 5.75,-0.75; 24 5.75,-0.25; 25 5.75,0.25; 26 5.75,0.75; 27 5.75,1.25; 28 5.75,1.75; 29 5.75,2.25; 30 5.75,2.75; 31 5.75,3.25; 32 5.75,3.75; 49 -5.75,3.75; 50 -5.75,3.25; 51 -5.75,2.75; 52 -5.75,2.25; 53 -5.75,1.75; 54 -5.75,1.25; 55 -5.75,0.75; 56 -5.75,0.25; 57 -5.75,-0.25; 58 -5.75,-0.75; 59 -5.75,-1.25; 60 -5.75,-1.75; 61 -5.75,-2.25; 62 -5.75,-2.75; 63 -5.75,-3.25; 64 -5.75,-3.75
SOT-23-5 = smd 0.55 x 1.2: 1 -0.95,-1.3; 2 0,-1.3; 3 0.95,-1.3; 4 0.95,1.3; 5 -0.95,1.3
BMP180 = smd 0.75 x 0.8: 1 -1.6,1.45; 2 -1.6,0; 3 -1.6,-1.45; 4 1.6,-1.45; 5 1.6,0; 6 1.6,1.45 | smd 0.8 x 0.75: 7 0,1.55
USB-MICRO-B = smd 0.35 x 1.4: D+ 0,2.65; D- -0.65,2.65; GND 1.3,2.65; ID 0.65,2.65; VBUS -1.3,2.65 | smd 1.8 x 1.9: MT1 -4,0; MT2 4,0

### Placement (x,y rotation side)
C1  22.12,45 270 top
C2  33.69,45.69 90 top
C3  17.44,41.75 180 top
C4  33,34.25 0 top
C5  35.75,35.12 90 top
C6  23,37.75 90 top
C7  29.62,37.62 90 top
C8  16.12,45 270 top
C9  17.88,47.62 180 top
C10  19.69,40.44 0 top
C11  26.25,39.75 180 top
C12  15.75,39.12 270 top
C13  31.5,31.75 0 top
C14  19.5,32.25 0 top
C15  32.06,30.19 0 top
C16  19,30.75 0 top
C17  32.25,25.25 180 bottom
C18  32.25,28.25 180 bottom
C19  36.25,23 90 top
C20  36.25,20.12 90 top
C21  21.75,23 180 bottom
C22  21.75,21 180 bottom
C23  27.25,20.5 0 bottom
C24  33.75,18.25 180 top
C25  25,3 270 top
C26  18.75,14.5 90 bottom
C27  22.25,11.12 270 bottom
C28  26.75,15.62 180 bottom
C29  29.5,13 270 bottom
C30  26.75,10.31 0 bottom
C31  26.75,42.88 90 bottom
C32  29.88,45.62 180 bottom
C33  32.5,42.88 270 bottom
CON1  5.25,26.12 90 bottom
CON2  44.81,27.5 90 top
CON3  44.81,17.5 90 top
CON4  5.25,35.25 270 top
CON5  5.25,27.5 270 top
CON6  5.25,18.88 90 bottom
D1  22.25,14.5 90 bottom
F1  14.12,16 180 bottom
F2  17,10.88 180 bottom
FB1  32.25,26.75 180 bottom
FID1  35.75,13.5 0 bottom
FID2  11.94,36.12 0 bottom
FID3  35.75,12.25 0 top
FID4  11.94,36.12 0 top
J1  34.5,6.5 270 top
J2  32,6.5 270 top
J3  29.5,6.5 270 top
J4  27,6.5 270 top
J5  23,6.5 270 top
J6  20.5,6.5 270 top
J7  18,6.5 270 top
J8  15.5,6.5 270 top
JP1  9,23.94 90 top
JTAG1  15.38,14.5 315 top
LED1  48.38,37.75 180 top
LED2  48.38,35.75 180 top
LED3  48.38,14.25 180 top
LED4  48.38,12.25 180 top
Q1  33.75,21.62 270 top
R3  26.31,47.5 0 top
R4  33,39.25 180 top
R5  29.62,34.38 270 top
R8  7.75,16.25 0 top
R9  7.75,17.5 0 top
RA1  27,10.75 270 top
RA2  23,10.75 270 top
RA3  35.5,15.62 0 top
RA4  14.12,31.25 0 top
TP1  13.62,20.94 0 bottom
TP2  8.44,17.88 0 bottom
TP3  36.75,5.25 0 bottom
TP4  36.75,2.69 0 bottom
TP5  31.5,12.31 0 top
TP6  31.5,14.88 0 top
TP7  29.75,28.31 0 bottom
TP8  29.94,19.06 0 bottom
TP9  26.94,18.62 0 bottom
TP10  42.75,31 0 bottom
TP11  42.75,29 0 bottom
TP12  23.75,32.12 0 top
U1  28.88,44.38 270 top
U2  26.25,36.5 90 top
U3  33,36.75 90 top
U4  19.62,45 180 top
U6  11.94,22.69 270 top
U7  25,24.75 90 top
U8  26.75,13 90 bottom
U9  29.88,42.88 0 bottom
U$28  19,36.88 270 top
USB1  1.5,16.5 270 top

### Tracks (layer width: path | path; a pad name or v marks a point on that pad's centre or on a via)
3.3V  (via drill 0.36, 0.5, 0.6)
  Top 0.203: C16.2 21,30.75 U7.32 21.25,30 20.75,29.5 v20.25,29.5 | C13.1 28.25,31.75 27.75,31.25 U7.19 | C24.2 32.5,18.25 31.25,19.5 31.25,20.5 U7.1 30,21 v29.25,20.25 28.75,19.75 U7.64 | U7.48 19.25,20.75 v20,20 | v29.62,32.75 R5.2 | U2.13 27.5,39.15 C11.1 | 32.38,34.5 32.5,34.5 32.5,36 32.25,36.25 U3.10 | U4.4 20.5,45.75 18.88,44.12 U4.13 18.38,43.63 v17.44,42.69 | U1.7 32.23,45.01 | U1.8 32.34,46.28 | v12,22.69 12.39,22.69 U6.5 | R3.1 25.12,47.5 v24.5,46.88 | U1.3 28.44,43.75 29,43.19 29,42.19 27.56,40.75 v27,40.75 | v14.94,29.19 14.94,30.04 RA4.D2 RA4.C2 | v12.19,32.44 13.31,32.44 RA4.A1 RA4.B1
  Top 0.254: 49.2,13.25 v48.38,13.25 | 49.2,13.25 LED3.1 | LED4.1 49.2,13.25
  Top 0.305: C4.1 32.35,34.48 32.38,34.5 | U1.7 30.12,45 29.88,45.25 29.88,46.06 30.09,46.28 U1.8 | 32.23,45.01 32.26,45.04 C2.1 34.94,43.79 34.94,41.25 v34.38,40.69 | 49.2,36.75 LED1.1 | 49.2,36.75 v48.38,36.75 | LED2.1 49.2,36.75
  Top 0.406: v10.75,13.38 12.2,14.82 JTAG1.1 | 15.75,37.62 16.5,36.88 18.19,36.88 19,37.69 U$28.2 | 15.75,37.62 C12.2 | 15.75,37.62 15.38,37.25 v15.38,36.88 | C11.1 26.9,40.65 v27,40.75 | C4.1 32.35,33.15 v32.38,33.12 | v31.5,32.75 30.85,32.1 C13.1 30.85,30.5 C15.1 | R4.2 32.35,39.6 v33,40.25 | C3.1 18.09,42.04 v17.44,42.69
  Top 0.61: JP1.3 v10.75,24.75 | JP1.3
  Bottom 0.203: TP8.1 29.94,19.81 29.5,20.25 v29.25,20.25
  Bottom 0.305: v29.25,20.25 28.15,20.25 C23.1 | v20,20 20.1,20 C22.1
  Bottom 0.406: U8.5 28.05,10.71 C30.1 v29.12,10.31
  other vias: 31.5,12.31
  pour Route15: 0,0 0,50 13.38,50 17.62,45.75 17.62,43 21.62,43 21.62,45.75 25.88,50 50,50 50,0
3.3VA  (via drill 0.5)
  Top 0.203: C1.2 21.73,44.75 U4.2
  Top 0.305: U3.2 34.75,36.25 34.88,36.12 34.88,35.35 C5.1 | v19.69,41.44 19.69,41.09 C10.1 17.55,38.95 U$28.3
  Top 0.406: v43.12,22.5 44.12,21.5 CON3.5 | v35.75,33.38 C5.1 | C1.2 23.29,44.35 v23.31,44.38
  Route15 0.406: 35.75,29 42.25,22.5 v43.12,22.5 | 35.75,29 35.5,29.25 v34.12,29.25 | 35.75,29 v35.75,33.38 35.75,42.5 34.62,43.62 v33.88,43.62 31.75,41.5 27.62,41.5 24.75,44.38 v23.31,44.38 20.38,41.44 v19.69,41.44
  Bottom 0.203: TP7.1 31.54,28.31 C18.1
  Bottom 0.305: C18.1 32.25,27.6 32.25,27.5 33,26.75 FB1.2
  Bottom 0.406: v34.12,29.25 32.25,29.25 31.6,28.6 C18.1 31.6,28.48 | v33.88,43.62 33.73,43.77 C33.1 32.1,44.17 U9.5
ADC0
  Top 0.203: U7.11 38.75,26 39.88,24.88 39.88,24.25 43.62,20.5 CON3.4
ADC1
  Top 0.203: U7.10 38.44,25.5 39.38,24.56 39.38,23.81 43.69,19.5 CON3.3
ADC2
  Top 0.203: U7.9 38,25 38.88,24.12 38.88,23.44 43.81,18.5 CON3.2
ADC3
  Top 0.203: U7.8 37.56,24.5 38.38,23.69 38.38,23.06 43.94,17.5 CON3.1
CS  (via drill 0.36)
  Top 0.203: v8,30.25 11.75,30.25 13.5,28.5 U7.33
  Bottom 0.203: v8,30.25 6.88,29.12 CON1.4
GND  (via drill 0.36, 0.5)
  Top 0.203: v28.5,29 28.25,29.25 U7.18 | U7.12 29.5,26.5 v29.25,26.25 | U7.63 28.25,20.5 v27.25,21.5 | U2.18 25,39.15 C11.2 | U4.9 18.75,45.75 18.88,45.62 18.88,44.88 18.75,44.75 U4.11 17.38,44.75 v17.12,45 | U6.3 11.21,22.04 v11.94,21.31 | v25.5,40.75 26.26,41.51 U1.4 | C20.2 36.9,20.12 v37.25,20.12 | C19.2 36.9,23 v37.25,23
  Top 0.305: C13.2 v33.25,31.75 | C24.1 v35.5,18.25 | USB1.GND 5.7,15.2 v5.75,15.25 | C5.2 35.75,36.12 35.12,36.75 U3.3 | C8.2 16.98,45 v17.12,45 | v33.38,11.81 33.38,13.5 34.25,14.38 34.65,14.38 RA3.D1 | C2.2 v33.69,47.38
  Top 0.406: J5.3 23.93,2.35 | v17.5,32.25 C14.1 | v17.25,30.75 C16.1 | JTAG1.9 16.88,12.41 16.88,13 16.5,13.38 16.38,13.38 | 16.38,13.38 16,13.38 14.89,12.27 JTAG1.7 | JTAG1.5 15.12,14.25 15.62,14.25 | 15.62,14.25 16.38,13.5 16.38,13.38 | JTAG1.3 14.2,15.12 v14.75,15.12 15.62,14.25 | C12.1 16.6,40.62 v17,40.62 | C6.2 22.98,38.38 v21.75,38.38 21.75,37.44 21.19,36.88 U$28.7 | C10.2 21.06,40.44 v21.25,40.62 | C11.2 25.6,40.65 v25.5,40.75 | C7.2 v29.62,39.62 | C4.2 33.65,33.15 v33.62,33.12 | C5.2 36.73,35.77 v36.88,35.62 | C3.2 v15.88,41.75 | C1.1 23.29,45.65 v23.31,45.62 | J4.3 26.07,2.35 C25.2 24,2.35 | CON3.6 v46.5,22.5 | CON2.6 v46.5,32.5 | v3.5,35.25 CON4.1 | C15.2 33.52,30.75 v34,30.75
  Top 0.61: CON5.1 8.06,27.5 v8.5,27.06
  Top 1.016: J8.3 J5.3 | J4.3 J1.3
  Bottom 0.305: C17.2 33.5,25.25 34.25,26 v34.25,26.81 34.25,27.5 33.5,28.25 C18.2 | C23.2 27.25,21.15 v27.25,21.5 | C21.2 22.6,22.65 v23.25,22 22.4,21.15 C22.2
  Bottom 0.406: U8.2 24.12,13 v24,12.88 24,11.19 | v29.62,39.62 29.88,39.88 U9.2 | v29.5,47 30.52,45.98 C32.2 | TP4.1 35.48,1.42 J1.3 | CON1.6 6.31,31.12 v6.75,31.56 | v3.56,21.88 CON6.4 | 24,11.19 23.04,10.22 C27.2 | 24,11.19 24.88,10.31 C30.2 | C31.2 26.75,44.56 v28,45.81 | C33.2 33.6,41.98 v33.88,42.25
  Bottom 0.61: C29.2 29.5,12 v30.12,11.38 | C26.2 18.75,15.25 v19.5,16 | C28.2 28.69,15.62 v28.75,15.56
  Bottom 1.016: J8.3 J5.3 23,1.44 | J4.3 J1.3
  pour Route2: 0,0 0,50 13.62,50 17.5,46 17.5,43 21.75,43 21.75,46 25.62,50 50,50 50,0
GPS_TX  (via drill 0.36)
  Top 0.203: v21.75,17.25 22.25,17.75 U7.51
  Bottom 0.203: v21.75,17.25 21.5,17.5 19.38,17.5 17,19.88 13.62,19.88 | 13.62,19.88 TP1.1 | CON6.2 13.62,19.88
GPX_RX  (via drill 0.36)
  Top 0.203: v22.75,16.5 U7.52
  Bottom 0.203: v22.75,16.5 21.25,16.5 20.75,17 19,17 17.12,18.88 8.44,18.88 | CON6.1 8.44,18.88 | 8.44,18.88 TP2.1
MISO  (via drill 0.36)
  Top 0.203: v8.44,28.5 12,28.5 13,27.5 U7.35
  Bottom 0.203: v8.44,28.5 7.06,27.12 CON1.2
MOSI  (via drill 0.36)
  Top 0.203: v13.5,26.75 13.75,27 U7.36
  Bottom 0.203: v13.5,26.75 13.25,27 9.94,27 9.06,26.12 CON1.1
N$1  (via drill 0.36)
  Top 0.203: U7.13 29.5,27 v29.25,27.25
  Bottom 0.305: C17.1 31.6,26.55 FB1.1 30.9,27.25 v29.25,27.25
N$2
  Top 0.203: C19.1 33.77,22.35 Q1.3 32.62,23.5 U7.6
N$3
  Top 0.203: U7.5 31.5,23 32,22.5 32.12,22.5 Q1.1 35.15,19.48 C20.1
N$4
  Bottom 0.61: D1.2 20.95,15.45 19.35,13.85 C26.1 18.73,13.88 17.75,13.88 16.74,14.88 F1.2
N$5
  Bottom 0.406: U8.4 29.2,13.95 C29.1
N$6
  Top 0.61: JP1.2 7.75,23.94 7.12,24.56 7.12,25.88 6.5,26.5 CON5.2
N$7
  Bottom 0.406: U9.4 28.93,45.33 C32.1
N$8
  Top 0.203: USB1.D+ 6.85,16.5 R8.1
N$9
  Top 0.203: USB1.D- 6.75,17.15 R9.1
N$10
  Top 0.203: R9.2 9.75,17.5 12.5,20.25 15.25,23 U7.44
N$11
  Top 0.203: R8.2 9.5,16.25 15.75,22.5 U7.45
N$12  (via drill 0.5)
  Route15 0.61: v28.12,42.75 30.75,45.38 35.62,45.38 37.06,43.94 37.06,38.12 44.88,30.31 44.88,21.12 39.06,15.31 36.38,15.31 34.56,13.5 27.38,13.5 26.56,14.31 22.5,14.31 v22.31,14.5
  Bottom 0.203: 28.12,41.62 28.32,41.62 28.38,41.58
  Bottom 0.406: 26.75,14 26.75,12.5 26.25,12 25.5,12 U8.1 | D1.3 23.9,13.95 U8.3 25.5,14 26.75,14 | U9.1 30.82,42.42 30.5,42.75 29.25,42.75 28.93,42.42 U9.3 28.38,41.58 27.15,41.58 C31.1 | v28.12,42.75 28.12,41.62 | 26.75,14 26.75,14.72 C28.1
  Bottom 0.61: v22.31,14.5 D1.3
N$13
  Top 0.203: U7.43 15,23.5 13.56,22.06 13.06,22.06 U6.4
N$14  (via drill 0.36)
  Top 0.203: v21.38,28.75 22.25,28.75 23.25,29.75 U7.28 | v12,23.94 12,23.81 11.56,23.38 10.88,23.38 U6.1
  Bottom 0.203: v21.38,28.75 16.5,28.75 13.62,25.88 13.62,25.56 v12,23.94
N$15
  Top 0.203: U4.8 18.88,47.27 C9.1
N$16
  Top 0.203: U4.12 17.81,44.25 16.81,43.25 15.38,43.25 15.12,43.5 15.12,46.62 16.12,47.62 C9.2
N$17
  Top 0.203: U2.8 28.9,35.75 R5.1 29.62,35 28.75,34.12 28.75,33.25 27.25,31.75 U7.20
N$18  (via drill 0.36)
  Top 0.203: U4.15 19.88,43.06 v20.25,42.69 | v21,26.25 20.25,25.5 U7.39
  Route15 0.203: v16.38,29.56 19.69,26.25 v21,26.25
  Bottom 0.203: v16.38,29.56 16.38,37.88 18.25,39.75 18.25,41.75 19.19,42.69 v20.25,42.69
N$19
  Top 0.203: TP12.1 U7.27
N$20
  Top 0.203: U4.10 17.88,45.25 17.27,45.85 C8.1
N$22  (via drill 0.36)
  Top 0.203: v25.75,29 U7.23 | v23.38,34.12 23.38,34.88 23.75,35.25 U2.24 | U3.9 31.25,36.75 31.12,36.62 31.12,34.12 v30.75,33.75 | v31.5,40.25 v31.49,40.26 U1.5
  Bottom 0.203: v23.38,34.12 25.75,31.75 v25.75,29 25.75,28 26.25,27.5 27,27.5 27.5,28 27.5,29.62 30.75,32.88 v30.75,33.75 31.5,34.5 v31.5,40.25
N$23  (via drill 0.36)
  Top 0.203: U7.29 22.75,32.12 22.12,32.75 v22.12,34.62 22.12,35.06 21.12,36.06 19.31,36.06 19,35.75 U$28.5 19,34.75 18.62,34.38 17.44,34.38 15.51,32.45 RA4.A2 14.94,32.46 | U4.1 21,44 v23,42
  Bottom 0.203: v23,42 23,37.5 22.12,36.62 v22.12,34.62
N$24  (via drill 0.36)
  Top 0.203: 20.52,33.6 22.25,31.88 U7.30 | U4.16 21,43.01 21,42.25 22.12,41.12 v22.12,39.75 | 20.52,33.6 20.45,33.67 U$28.6 | 20.52,33.6 20.5,33.62 v19.5,33.62 17.69,33.62 15.75,31.69 14.96,31.69 RA4.B2
  Bottom 0.203: v22.12,39.75 21.5,39.75 19.5,37.75 v19.5,33.62
N$25  (via drill 0.36)
  Top 0.203: U7.22 26.25,32 v27.62,33.38 | U2.9 30,36.25 v30.25,36 30.62,36.38 30.62,36.88 31,37.25 U3.8 | 26.36,45.01 U1.2 28.19,45 29.44,43.75 29.44,41.44 28.38,40.38 v28.38,39
  Route15 0.203: v28.38,39 28.38,37.88 v30.25,36
  Bottom 0.203: v27.62,33.38 v30.25,36
N$26  (via drill 0.36)
  Top 0.203: U7.26 24.25,29.5 v23.5,28.75 | v24.25,39.25 24.25,45.25 25.28,46.28 U1.1 26.96,46.98 R3.2
  Route15 0.203: v23.5,28.75 24.88,30.12 24.88,38.62 v24.25,39.25
N$27  (via drill 0.36)
  Top 0.203: v26.75,28.25 U7.21 | v22.88,35.62 23,35.75 U2.23 | U3.7 31.12,37.75 30.75,38.12 v30.75,38.75 30.5,39 30.5,40.88 29.94,41.44 29.94,43.12 30.55,43.74 U1.6 31.24,43.74
  Bottom 0.203: v26.75,28.25 26.75,31.75 v22.88,35.62 24.62,37.38 29.38,37.38 v30.75,38.75
N$28  (via drill 0.36)
  Top 0.203: U7.24 25.25,32.25 v26.38,33.38 | v26.38,35.5 26.38,36.5 27.62,37.75 U2.12
  Bottom 0.203: v26.38,33.38 v26.38,35.5
N$30  (via drill 0.36)
  Top 0.203: U7.4 29.5,22.5 v28.5,23.5 | v37.62,29.25 37.62,36 36.38,37.25 U3.4
  Bottom 0.203: v28.5,23.5 32.88,23.5 37.62,28.25 v37.62,29.25
N$31
  Top 0.203: U2.20 23.15,37.25 C6.1
N$32
  Top 0.203: U2.10 29.4,36.75 C7.1
N$33  (via drill 0.36)
  Top 0.203: U7.3 28.25,22 v27.5,22.75 | v38.62,29.25 38.62,35.75 36.62,37.75 U3.5
  Top 0.305: U3.5 34.2,38.7 R4.1
  Bottom 0.203: v38.62,29.25 38.62,28.5 32.88,22.75 v27.5,22.75
N$34
  Top 0.203: J2.1 30.5,8 29,8 27.4,9.6 RA1.B2
N$35
  Top 0.203: J3.1 26.6,9.4 RA1.C2
N$36
  Top 0.203: J4.1 27,7.75 25.75,9 25.75,9.9 RA1.D2
N$37
  Top 0.203: J1.1 32.5,8.5 29.25,8.5 28.2,9.55 RA1.A2
N$38
  Top 0.203: J6.1 23.4,9.4 RA2.B2
N$39
  Top 0.203: J7.1 19.5,8 21,8 22.6,9.6 RA2.C2
N$40
  Top 0.203: J8.1 17.5,8.5 20.5,8.5 21.8,9.8 RA2.D2
N$41
  Top 0.203: J5.1 23,7.75 24.25,9 24.25,9.9 RA2.A2
N$42
  Top 0.203: U7.58 25.75,11.6 RA1.D1
N$43
  Top 0.203: RA1.C1 26.6,11.9 26.25,12.25 U7.59
N$44
  Top 0.203: U7.61 27.25,17.94 27.69,17.5 27.69,16.56 27.25,16.12 27.25,11.7 RA1.B1
N$45
  Top 0.203: RA1.A1 28.2,12.05 27.75,12.5 27.75,15.81 28.25,16.31 28.25,17.69 27.75,18.19 U7.62
N$46  (via drill 0.36, 0.6)
  Top 0.203: v26.94,17.12 26.75,17.31 U7.60
  Bottom 0.203: TP6.1 29.25,17.12 v26.94,17.12 TP9.1
  other vias: 31.5,14.88
N$47
  Top 0.203: RA2.A1 24.2,11.95 25.25,13 U7.57
N$48
  Top 0.203: RA2.B1 23.4,11.85 23.25,12 23.25,13.31 24.75,14.81 U7.56
N$49  (via drill 0.36)
  Top 0.203: U7.37 15.25,26.5 v14.75,26 | v15.5,21.25 9.12,14.88 9.12,13.12 10.25,12 11.12,12 13.88,9.25 19.88,9.25 21.38,10.75 22.38,10.75 22.62,11 22.62,11.53 RA2.C1
  Bottom 0.203: v14.75,26 14.75,22 v15.5,21.25
N$50  (via drill 0.36)
  Top 0.203: RA2.D1 21.43,11.55 19.75,9.88 14.38,9.88 11.62,12.62 10.38,12.62 9.75,13.25 9.75,14.5 v16.88,21.62 | v16.19,25.69 16.5,26 U7.38
  Bottom 0.203: v16.88,21.62 16.19,22.31 v16.19,25.69
N$51  (via drill 0.36)
  Top 0.203: RA3.A2 36.3,17.3 v36.94,17.94 | v45.88,36.69 46.94,37.75 LED1.2
  Bottom 0.203: v36.94,17.94 40.44,17.94 44.06,21.56 44.06,34.88 v45.88,36.69
N$52  (via drill 0.36)
  Top 0.203: RA3.B2 37.02,16.02 v37.94,16.94 | v46.38,34.62 47.5,35.75 LED2.2
  Bottom 0.203: v37.94,16.94 40.69,16.94 44.88,21.12 44.88,33.12 v46.38,34.62
N$53
  Top 0.203: RA3.C2 45.84,15.22 46.81,14.25 LED3.2
N$54
  Top 0.203: RA3.D2 44.64,14.43 46.81,12.25 LED4.2
N$55  (via drill 0.36)
  Top 0.203: U7.53 23.25,17.38 v23.88,16.75 | v30.75,16.62 31.25,16.12 34.6,16.12 RA3.B1
  Route15 0.203: v23.88,16.75 24.25,16.38 27.81,16.38 28.06,16.62 v30.75,16.62
N$56  (via drill 0.36)
  Top 0.203: U7.54 23.75,18 v24.06,17.69 | v29.25,17.88 31.88,17.88 32.88,16.88 34.65,16.88 RA3.A1
  Route15 0.203: v24.06,17.69 24.25,17.88 v29.25,17.88
N$57  (via drill 0.36)
  Top 0.203: U7.2 29.12,21.5 v28.88,21.25 | v33,15.25 34.67,15.25 RA3.C1
  Bottom 0.203: v28.88,21.25 29.5,21.25 33,17.75 v33,15.25
RC_RX  (via drill 0.36)
  Top 0.203: U6.2 10.12,22.69 9.81,22.38 v9.81,21.12 | CON5.4 5.25,23.5 v5.75,23
  Bottom 0.203: v5.75,23 8.69,23 9.81,21.88 v9.81,21.12
RC_TX  (via drill 0.36)
  Top 0.203: U7.42 13.06,24 10.75,26.31 v10.44,26.31 | v3.38,25.5 CON5.3
  Route2 0.203: v3.38,25.5 9.62,25.5 v10.44,26.31
RST  (via drill 0.36)
  Top 0.203: U7.7 29.56,24 29.25,24.31 26.94,24.31 26.69,24.06 26.62,24 v25,22.38 | v23.88,15.62 20.34,15.62 18.8,14.08 JTAG1.10
  Bottom 0.203: v25,22.38 25,16.75 v23.88,15.62
SCK  (via drill 0.36)
  Top 0.203: v9.31,29.5 11.75,29.5 13.25,28 U7.34
  Bottom 0.203: v9.31,29.5 9.19,29.38 8.12,29.38 6.88,28.12 CON1.3
SCL  (via drill 0.36)
  Top 0.203: U7.41 13.5,24.5 v10.25,27.75 | CON4.3 5.31,33.19 8.88,33.19 v10.25,31.81 11.75,31.81 12.71,30.85 RA4.C1
  Bottom 0.203: v10.25,27.75 v10.25,31.81
SDA  (via drill 0.36)
  Top 0.203: U7.40 14.25,25 v11.5,27.75 | CON4.4 5.38,32.38 8.44,32.38 9.88,30.94 v11.5,30.94 11.94,30.94 12.82,30.05 RA4.D1
  Bottom 0.203: v11.5,30.94 v11.5,27.75
TCLK
  Top 0.203: JTAG1.4 18.08,19 U7.49
TDI
  Top 0.203: U7.50 21.75,18.25 20.62,17.12 19.44,17.12 18.25,15.94 18.25,15.58 JTAG1.8
TDO  (via drill 0.36)
  Top 0.203: v24.25,20.75 U7.55 | JTAG1.6 17,15.88 19.44,18.31 v19.62,18.31
  Bottom 0.203: v24.25,20.75 21.81,18.31 v19.62,18.31
TELEM_CTS
  Top 0.203: U7.14 CON2.1
TELEM_RTS
  Top 0.203: U7.15 43.62,28 44.12,28.5 CON2.2
TELEM_RX  (via drill 0.36)
  Top 0.203: U7.17 28.88,30.5 v30,29.38 | v41.56,29.12 41.94,29.5 CON2.3
  Bottom 0.203: v30,29.38 30.62,30 40.69,30 v41.56,29.12 41.69,29 TP11.1
TELEM_TX  (via drill 0.36)
  Top 0.203: U7.16 39.31,28.5 41.56,30.75 v41.56,31.12 42.19,30.5 CON2.4
  Bottom 0.203: v41.56,31.12 41.69,31 TP10.1
TMS
  Top 0.203: U7.46 18.5,22 15.62,19.12 15.62,18.34 JTAG1.2
VCAP  (via drill 0.36)
  Top 0.203: U7.47 21.25,21.5 v21.75,22
  Bottom 0.305: v21.75,22 21.75,22.15 C21.1
VCAP2
  Top 0.203: U7.31 21.75,31.5 21,32.25 C14.2
VCC  (via drill 0.5)
  Top 0.406: v3.5,33.69 4.06,34.25 CON4.2 | v46.62,31 46.12,31.5 CON2.5
  Top 0.61: JP1.1 9,22.62 8.44,22.06 v8.19,22.06
  Route15 0.813: v3.5,33.69 v3.5,30.12 3.5,29.19 3.5,28.38 8.19,23.69 v8.19,22.06 8.19,18.31 15.62,10.88 v17,10.88 19,8.88 33.5,8.88 38.44,13.81 41.44,13.81 48.38,20.75 48.38,29.25 v46.62,31
  Bottom 0.406: v8.19,22.06 7,20.88 CON6.3 | v3.5,30.12 CON1.5
  Bottom 0.61: v17,10.88 F2.2 20.77,12.03 | 20.77,12.03 C27.1 | D1.1 21.15,12.41 20.77,12.03
VCC_IN
  Top 0.406: J5.2 23.31,3.65 C25.1 26.69,3.65 J4.2
  Top 1.016: J5.2 J6.2 J7.2 J8.2 | J4.2 J3.2 J2.2 J1.2
  Route2 1.016: J8.2 J7.2 J6.2 J5.2 J4.2 J3.2 J2.2 J1.2
  Route15 1.016: J8.2 J7.2 J6.2 J5.2 J4.2 J3.2 J2.2 J1.2
  Bottom 0.406: J1.2 35.46,3.96 TP3.1
  Bottom 0.61: J5.2 23.21,3.96 | 26.75,4 27,4 J4.2 | J8.2 13.62,5.83 13.62,9.31 14.38,10.07 F2.1
  Bottom 1.016: J8.2 J7.2 J6.2 J5.2 J4.2 J3.2 J2.2 J1.2
VUSB  (via drill 0.36, 0.5)
  Top 0.203: v24.75,28.12 U7.25
  Top 0.406: USB1.VBUS 4.15,17.98 v3.25,18.88
  Route15 0.203: v13.38,16.5 24.75,27.88 v24.75,28.12
  Bottom 0.203: v13.38,16.5 12.88,16 F1.1
  Bottom 0.61: v3.25,18.88 5.62,16.5 10.88,16.5 11.38,16 F1.1

### Text on the board
Bottom: nov. 2011 | and | designed by | angus peart | david carlson
_tsilk: OmniRotor | by OmniLoco | Error | I2C | Warning | RC Input | Telemetry | 3.3V | RC | ADC+IO | Status | SBL | Power | 1 | 2 | 3 | 4 | 5 | 6 | 7 | 8 | ~ | ~ | CC-BY-SA | + | + | - | -
_bsilk: OmniRotor | by OmniLoco | SPI Bus | GPS